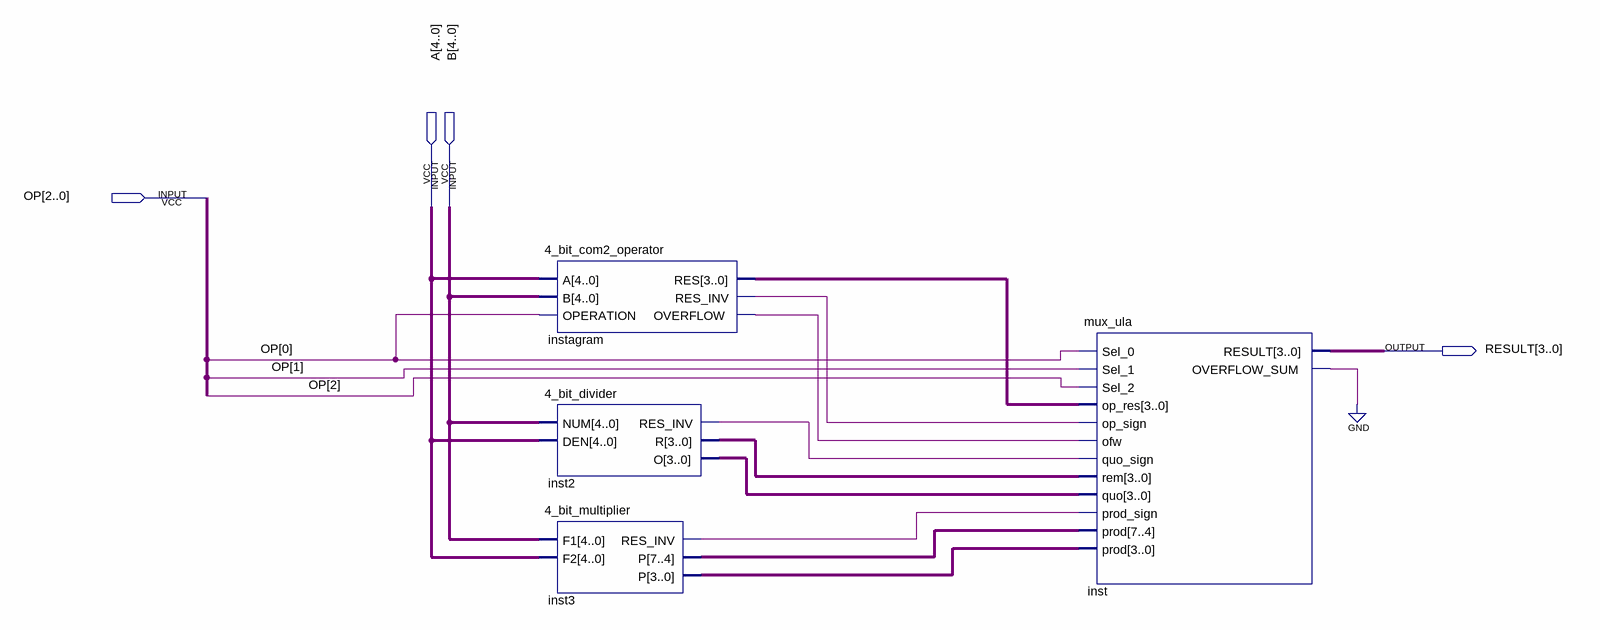
[diagram p0: schematic sheet]
// Quartus schematic alu_cpu.bdf as structural Verilog: 4 symbols, 4 pins
module alu_cpu (
  input  [2:0] OP,
  input  [4:0] A,
  input  [4:0] B,
  output [3:0] RESULT
);

  wire inst2_res_inv, inst3_res_inv, inst_overflow_sum, instagram_overflow, instagram_res_inv;
  wire [3:0] inst2_o, inst2_r, inst3_p, inst3_p_2, instagram_res;

  \4_bit_com2_operator  instagram (
    .A(A), .B(B), .OPERATION(OP[0]), .RES(instagram_res), .RES_INV(instagram_res_inv),
    .OVERFLOW(instagram_overflow));
  \4_bit_divider  inst2 (.NUM(B), .DEN(A), .RES_INV(inst2_res_inv), .R(inst2_r), .O(inst2_o));
  \4_bit_multiplier  inst3 (.F1(B), .F2(A), .RES_INV(inst3_res_inv), .P({inst3_p, inst3_p_2}));
  mux_ula inst (
    .Sel_0(OP[0]), .Sel_1(OP[1]), .Sel_2(OP[2]), .op_res(instagram_res), .op_sign(instagram_res_inv),
    .ofw(instagram_overflow), .quo_sign(inst2_res_inv), .rem(inst2_r), .quo(inst2_o),
    .prod_sign(inst3_res_inv), .prod({inst3_p, inst3_p_2}), .RESULT(RESULT), .OVERFLOW_SUM(inst_overflow_sum));
  // also tied to GND on the sheet: inst_overflow_sum
endmodule
